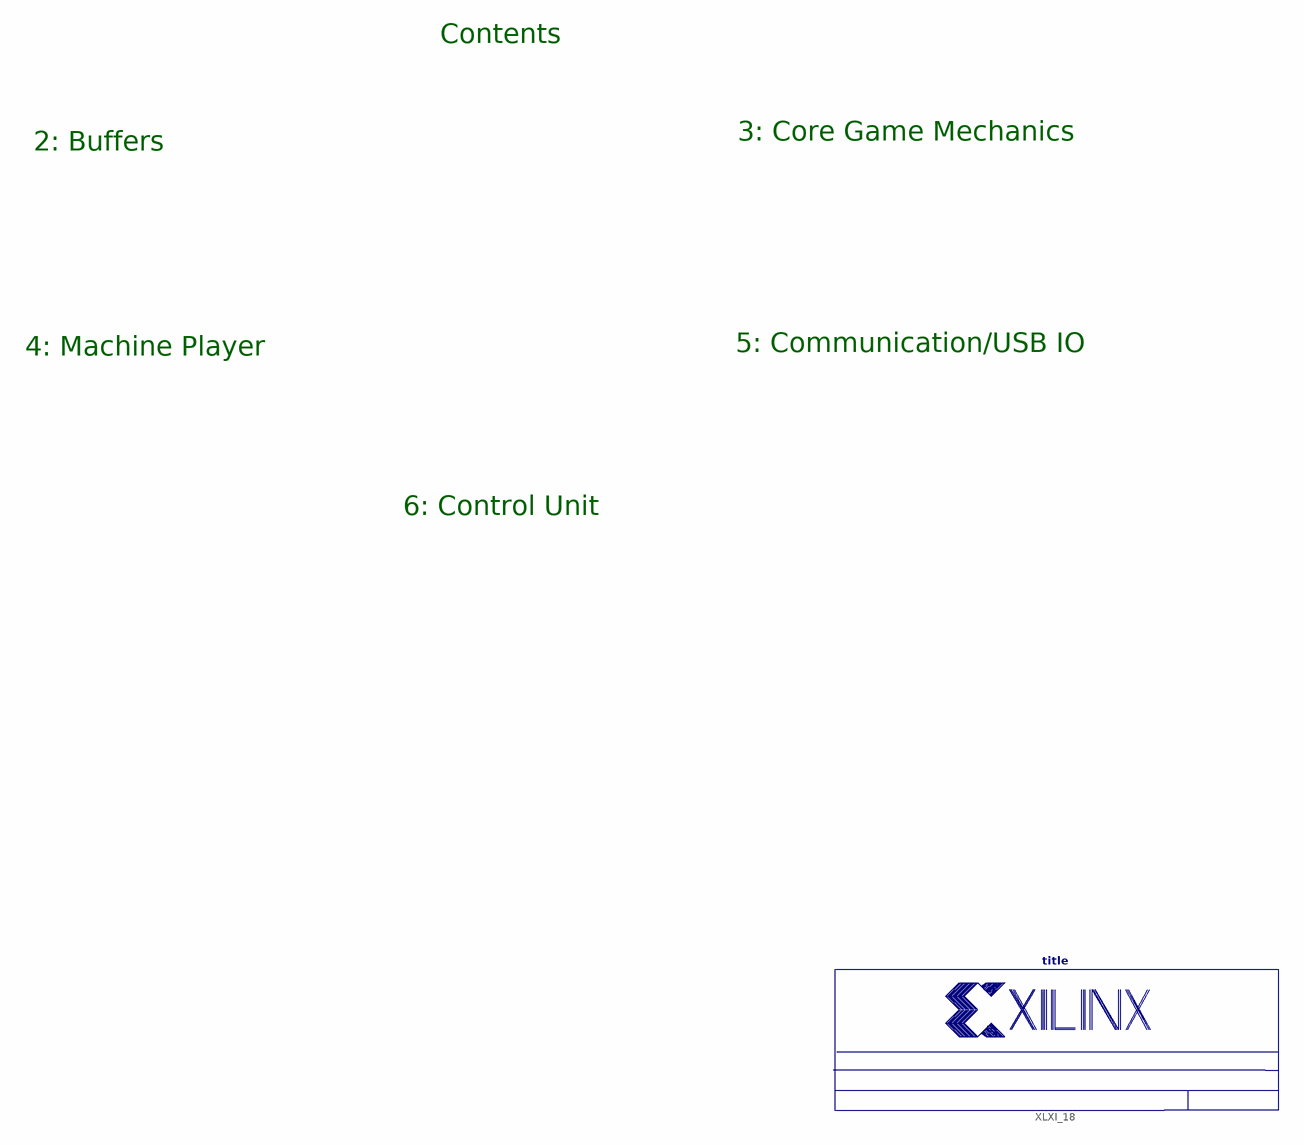
[diagram p0: schematic sheet 1]
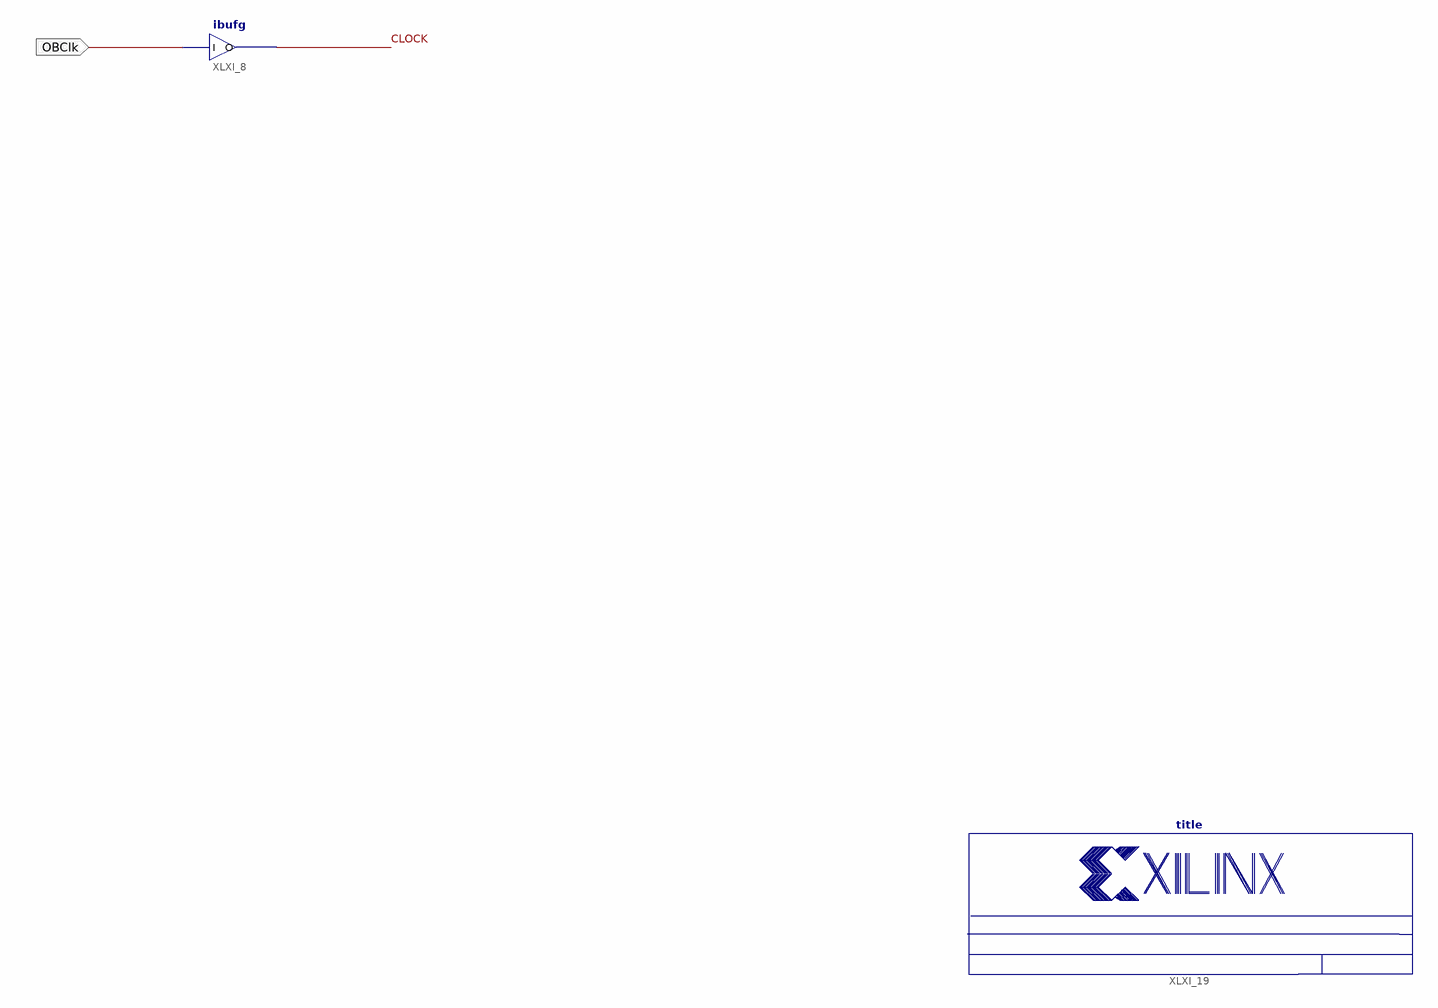
[diagram p1: schematic sheet 2]
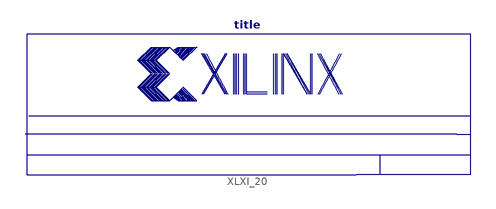
[diagram p2: schematic sheet 3]
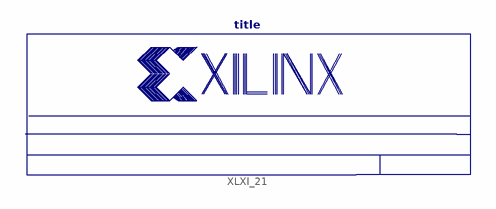
[diagram p3: schematic sheet 4]
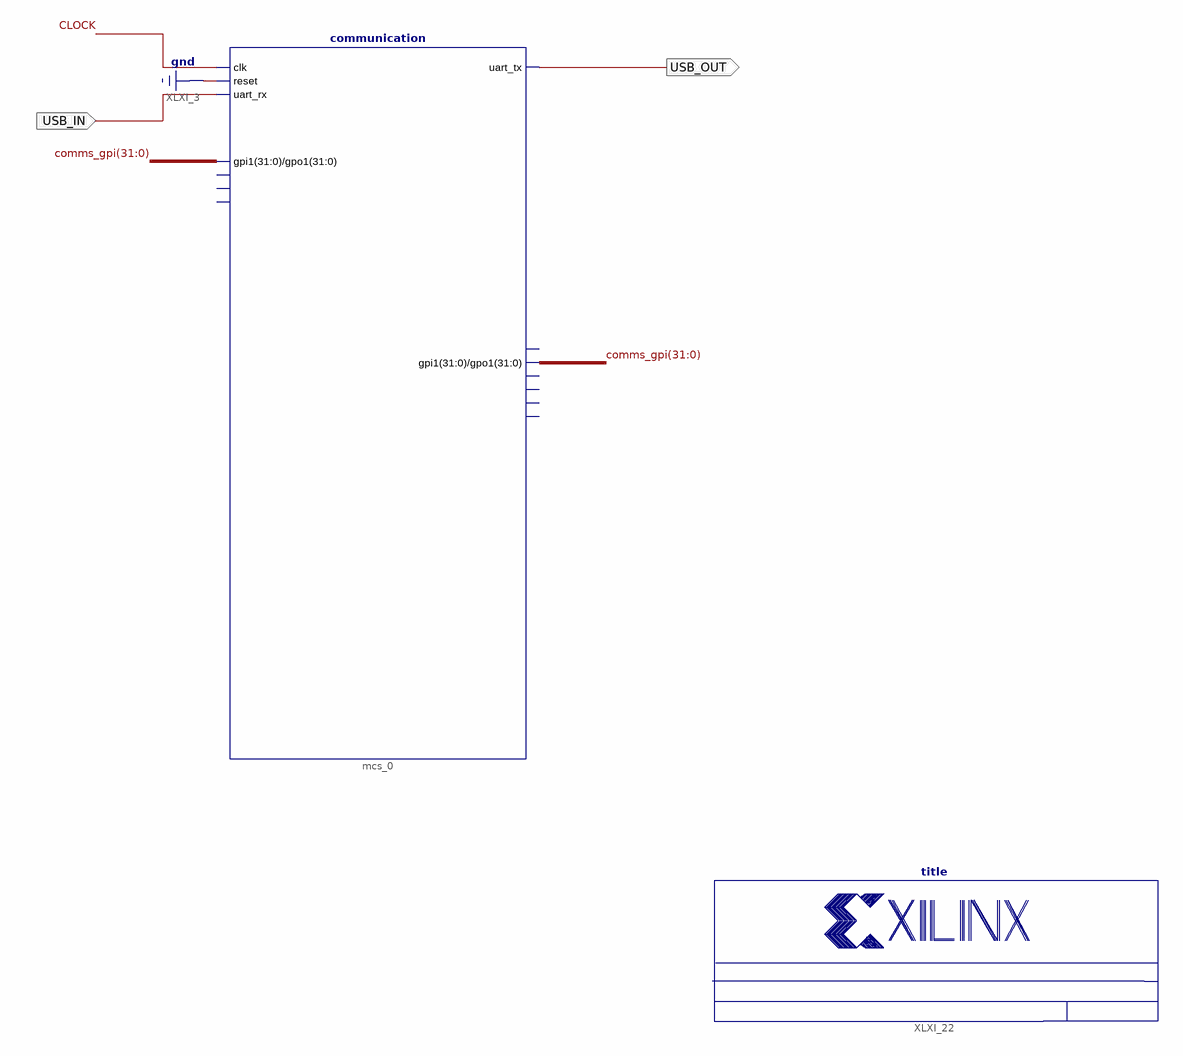
[diagram p4: schematic sheet 5]
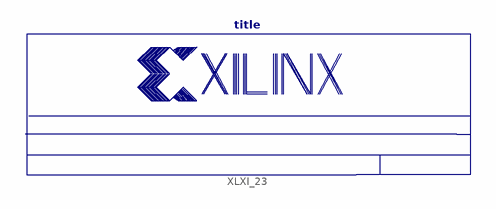
[diagram p5: schematic sheet 6]
// Xilinx ISE schematic gomoku.sch (artix7) as structural Verilog: 8 symbols, 3 ports
module gomoku (
  input  USB_IN,
  input  OBClk,
  output USB_OUT
);

  wire CLOCK;
  wire [31:0] comms_gpi;

  ibufg XLXI_8 (.I(OBClk), .O(CLOCK));
  title #(.TitleFieldText("Gomoku 1.0.0"), .NameFieldText("Ana, Kenan, Xikun, Varron")) XLXI_18 ();
  title #(.TitleFieldText("Gomoku 1.0.0"), .NameFieldText("Ana, Kenan, Xikun, Varron")) XLXI_19 ();
  title #(.TitleFieldText("Gomoku 1.0.0"), .NameFieldText("Ana, Kenan, Xikun, Varron")) XLXI_20 ();
  title #(.TitleFieldText("Gomoku 1.0.0"), .NameFieldText("Ana, Kenan, Xikun, Varron")) XLXI_21 ();
  title #(.TitleFieldText("Gomoku 1.0.0"), .NameFieldText("Ana, Kenan, Xikun, Varron")) XLXI_22 ();
  title #(.TitleFieldText("Gomoku 1.0.0"), .NameFieldText("Ana, Kenan, Xikun, Varron")) XLXI_23 ();
  communication mcs_0 (
    .clk(CLOCK), .reset(1'b0), .uart_tx(USB_OUT), .uart_rx(USB_IN), .gpi1(comms_gpi), .gpo1(comms_gpi));  // open: uart_interrupt, gpi2, gpi3, gpi4, gpo2, gpo3, gpo4, intc_irq

  // Notes on the sheet:
  //   Contents
  //   3: Core Game Mechanics
  //   2: Buffers
  //   5: Communication/USB IO
  //   4: Machine Player
  //   6: Control Unit
endmodule
